# Altium project IR2136_SMD.PrjPcb
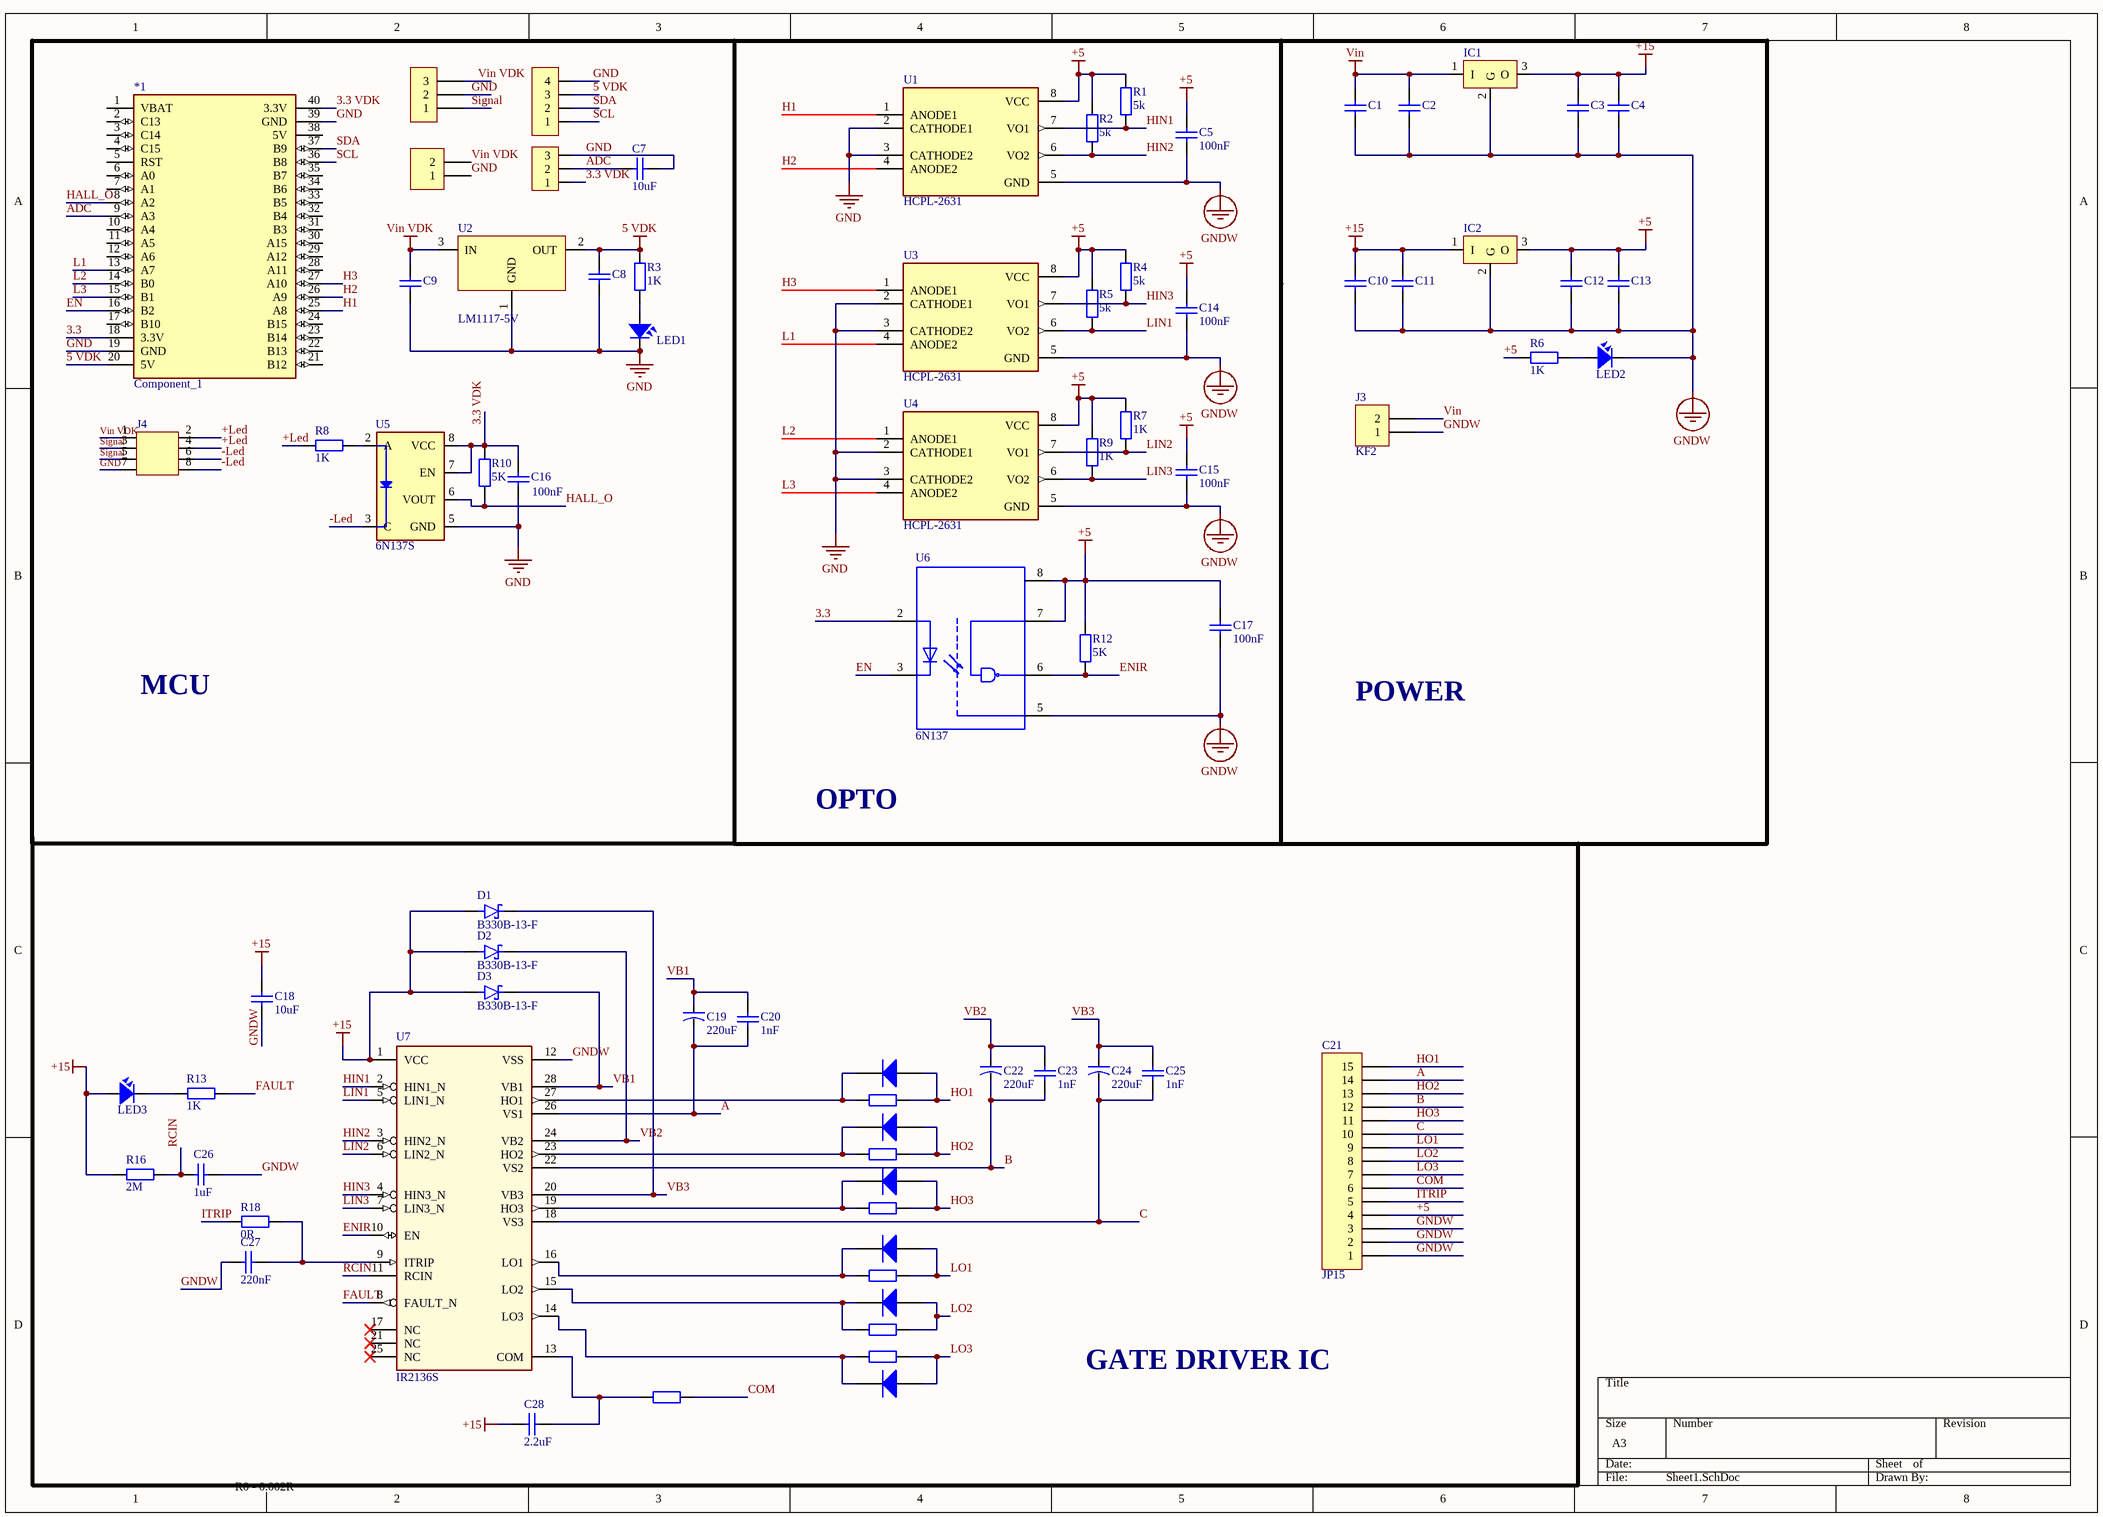
[diagram p0: Sheet1.SchDoc]
1 sheet, 76 parts. Net scope: global (net labels, ports and power ports of the same name join across sheets).
Board file: IR2136_SMD.PcbDoc

## Sheet Sheet1.SchDoc
size A3; SheetNumber: 1; SheetTotal: 1

### Parts
*1  Component_1  [PCBComponent_1]
C1  106  [tu 1206]  (value not drawn)
C2  106  [tu 1206]  (value not drawn)
C3  106  [tu 1206]  (value not drawn)
C4  106  [tu 1206]  (value not drawn)
C5  100nF  [tu 1206]
C6  Header3  [Header3]  (value not drawn)
C7  10uF  [tu 1206]
C8  106  [tu 1206]  (value not drawn)
C9  106  [tu 1206]  (value not drawn)
C10  106  [tu 1206]  (value not drawn)
C11  106  [tu 1206]  (value not drawn)
C12  106  [tu 1206]  (value not drawn)
C13  106  [tu 1206]  (value not drawn)
C14  100nF  [tu 1206]
C15  100nF  [tu 1206]
C16  100nF  [tu 1206]
C17  100nF  [tu 1206]
C18  10uF  [tu 1206]
C19  220uF  [CA-ALU-8]
C20  1nF  [tu 0805]
C21  JP15  [JP15-D1T]
C22  220uF  [CA-ALU-8]
C23  1nF  [tu 0805]
C24  220uF  [CA-ALU-8]
C25  1nF  [tu 0805]
C26  1uF  [tu 1206]
C27  220nF  [tu 1206]
C28  2.2uF  [tu 1206]
D1  B330B-13-F  [DIOM5336X240N]
D2  B330B-13-F  [DIOM5336X240N]
D3  B330B-13-F  [DIOM5336X240N]
D4  SS14  [DIODE SMA]  (value not drawn)
D5  SS14  [DIODE SMA]  (value not drawn)
D6  SS14  [DIODE SMA]  (value not drawn)
D7  SS14  [DIODE SMA]  (value not drawn)
D8  SS14  [DIODE SMA]  (value not drawn)
D9  SS14  [DIODE SMA]  (value not drawn)
IC1  LM78xx  [TO220-123]  (value not drawn)
IC2  LM78xx  [TO220-123]  (value not drawn)
J1  KF3  [KF3-5.08T]  (value not drawn)
J2  KF2  [KF2-5.08T]  (value not drawn)
J3  KF2  [KF2-5.08T]
J4  SAMTEC-TSM-102-01-X-DV  [SAMTEC-TSM-102-01-X-DV]  (value not drawn)
JP1  JP 1x4 2.54  [JP 1x4 DC]  (value not drawn)
LED1  LED  [LED-1206-Blue]  (value not drawn)
LED2  LED  [LED-1206-Blue]  (value not drawn)
LED3  LED  [LED-1206-Blue]  (value not drawn)
R1  5k  [tro smd 1206]
R2  5k  [tro smd 1206]
R3  1K  [tro smd 1206]
R4  5k  [tro smd 1206]
R5  5k  [tro smd 1206]
R6  1K  [tro smd 1206]
R7  1K  [tro smd 1206]
R8  1K  [tro smd 1206]
R9  1K  [tro smd 1206]
R10  5K  [tro smd 1206]
R12  5K  [tro smd 1206]
R13  1K  [tro smd 1206]
R14  680R  [tro smd 1206]  (value not drawn)
R15  680R  [tro smd 1206]  (value not drawn)
R16  2M  [tro smd 1206]
R17  680R  [tro smd 1206]  (value not drawn)
R18  0R  [tro smd 1206]
R19  680R  [tro smd 1206]  (value not drawn)
R20  680R  [tro smd 1206]  (value not drawn)
R21  680R  [tro smd 1206]  (value not drawn)
R22  1R  [tro smd 1206]  (value not drawn)
U1  HCPL-2631  [DIP762W65P254L965H470Q8]
U2  LM1117-5V  [SOT223]
U3  HCPL-2631  [DIP762W65P254L965H470Q8]
U4  HCPL-2631  [DIP762W65P254L965H470Q8]
U5  6N137S  [8-SMD]
U6  6N137  [DIP762W50P254L977H451Q8]
U7  IR2136S  [SOIC127P1032X265-28N]

### Blocks framed on the sheet
MCU: *1 C6-C9 C16 J1 J2 J4 JP1 LED1 R3 R8 R10 U2 U5

### Nets
5 VDK: *1.20(5V) C8.1 JP1.3 R3.1 U2.2(OUT)
+5: C5.2 C12.1 C13.1 C14.2 C15.2 C17.2 C21.4 IC2.3(O) R1.2 R2.2 R4.2 R5.2 R6.1 R7.2 R9.2 R12.2 U1.8(VCC) U3.8(VCC) U4.8(VCC) U6.7(VE) U6.8(VCC)
+15: C3.1 C4.1 C10.1 C11.1 C18.2 C28.2 D1.A D2.A D3.A IC1.3(O) IC2.1(I) LED3.1 R16.2 U7.1(VCC)
GND: *1.19(GND) *1.39(GND) C6.3 C7.1 C8.2 C9.2 C16.1 J1.2 J2.1 J4.7 JP1.4 LED1.2 U1.2(CATHODE1) U1.3(CATHODE2) U2.1(GND) U3.2(CATHODE1) U3.3(CATHODE2) U4.2(CATHODE1) U4.3(CATHODE2) U5.5(GND)
GNDW: C1.2 C2.2 C3.2 C4.2 C5.1 C10.2 C11.2 C12.2 C13.2 C14.1 C15.1 C17.1 C18.1 C21.1 C21.2 C21.3 C26.2 C27.2 IC1.2(G) IC2.2(G) J3.1 LED2.2 U1.5(GND) U3.5(GND) U4.5(GND) U6.5(GND) U7.12(VSS)
Vin: C1.1 C2.1 IC1.1(I) J3.2
Vin VDK: C9.1 J1.3 J2.2 J4.1 U2.3(IN)
3.3: *1.18(3.3V) U6.2(A)
3.3 VDK: *1.40(3.3V) C6.1 C16.2 R10.2 U5.7(EN) U5.8(VCC)
+Led: J4.2 J4.4 R8.2
-Led: J4.6 J4.8 U5.3(C)
A: C19.2 C20.2 C21.14 U7.26(VS1)
ADC: *1.9(A3) C6.2 C7.2
B: C21.12 C22.2 C23.2 U7.22(VS2)
C: C21.10 C24.2 C25.2 U7.18(VS3)
COM: C21.6 R22.1
EN: *1.16(B2) U6.3(C)
ENIR: R12.1 U6.6(VO) U7.10(EN)
FAULT: R13.2 U7.8(FAULT_N)
H1: *1.25(A8) U1.1(ANODE1)
H2: *1.26(A9) U1.4(ANODE2)
H3: *1.27(A10) U3.1(ANODE1)
HALL_O: *1.8(A2) R10.1 U5.6(VOUT)
HIN1: R1.1 U1.7(VO1) U7.2(HIN1_N)
HIN2: R2.1 U1.6(VO2) U7.3(HIN2_N)
HIN3: R4.1 U3.7(VO1) U7.4(HIN3_N)
HO1: C21.15 D4.1(A) R14.1
HO2: C21.13 D5.1(A) R15.1
HO3: C21.11 D6.1(A) R17.1
ITRIP: C21.5 R18.1
L1: *1.13(A7) U3.4(ANODE2)
L2: *1.14(B0) U4.1(ANODE1)
L3: *1.15(B1) U4.4(ANODE2)
LIN1: R5.1 U3.6(VO2) U7.5(LIN1_N)
LIN2: R7.1 U4.7(VO1) U7.6(LIN2_N)
LIN3: R9.1 U4.6(VO2) U7.7(LIN3_N)
LO1: C21.9 D7.1(A) R19.1
LO2: C21.8 D8.1(A) R20.1
LO3: C21.7 D9.1(A) R21.1
RCIN: C26.1 R16.1 U7.11(RCIN)
SCL: *1.36(B8) JP1.1
SDA: *1.37(B9) JP1.2
Signal: J1.1 J4.3 J4.5
VB1: C19.1 C20.1 D3.C(K) U7.28(VB1)
VB2: C22.1 C23.1 D2.C(K) U7.24(VB2)
VB3: C24.1 C25.1 D1.C(K) U7.20(VB3)
NetC27_1: C27.1 R18.2 U7.9(ITRIP)
NetC28_1: C28.1 R22.2 U7.13(COM)
NetD4_2: D4.2(K) R14.2 U7.27(HO1)
NetD5_2: D5.2(K) R15.2 U7.23(HO2)
NetD6_2: D6.2(K) R17.2 U7.19(HO3)
NetD7_2: D7.2(K) R19.2 U7.16(LO1)
NetD8_2: D8.2(K) R20.2 U7.15(LO2)
NetD9_2: D9.2(K) R21.2 U7.14(LO3)
NetLED1_1: LED1.1 R3.2
NetLED2_1: LED2.1 R6.2
NetLED3_2: LED3.2 R13.1
NetR8_1: R8.1 U5.2(A)

Not connected (* = marked no-connect by the designer): *1 1(VBAT) 2(C13) 3(C14) 4(C15) 5(RST) 6(A0) 7(A1) 10(A4) 11(A5) 12(A6) 17(B10) 21(B12) 22(B13) 23(B14) 24(B15) 28(A11) 29(A12) 30(A15) 31(B3) 32(B4) 33(B5) 34(B6) 35(B7) 38(5V); U7 17(NC)* 21(NC)* 25(NC)*

### Notes on the sheet
- POWER
- OPTO
- GATE DRIVER IC
- R0 - 0.002R

### Library data of the parts
C1-C4 C8-C13 = Tu 1206 106 16V 20%: Dán; Don_Vi: Con; So_Chan: 2; Ten_Linh_Kien: Tụ 1206 106-10uF 20% 16V; Ma_Hang: MH004541; Chung_Loai: Dán; Kieu_Chan: *
C5 C7 C14-C18 C26-C28 = Tu 1206 470pF 50V 10%: Dán; Don_Vi: Con; So_Chan: 2; Ten_Linh_Kien: Tụ 1206 470P 10% 50V; Ma_Hang: MH004548; Chung_Loai: Dán; Kieu_Chan: *
C6 = Header3: Header IDC, 3 x 1 Pin Vertical 2.54mm Pitch (Non-Boxed, Male); Manufacturer: W¨¹rth Elektronik eiSos GmbH; partNo: 613002143121; ComponentLink1 Description: Manufacturer; ComponentLink2 Description: Datasheet; NoPins: 02; Created Date: 29 March 2013; ComponentLink1URL: http://www.we-online.com; ComponentLink2URL: http://katalog.we-online.de/em/datasheet/6130xx143121.pdf; Created by: Karrer Zheng
C19 C22 C24 = CN-ALU-DIP: Capacitor (Semiconductor SIM Model); Value: 104; LatestRevisionDate: 17-Jul-2002; LatestRevisionNote: Re-released for DXP Platform.; PackageReference: C1206; Publisher: Altium Limited
C20 C23 C25 = Tu 0805 20pF 50V 10%: Dán; Don_Vi: Con; Ten_Linh_Kien: Tụ 0805 20P 10% 50V; So_Chan: 2; Ma_Hang: MH004558; Chung_Loai: Dán; Kieu_Chan: *
C21 = JP15: WR-PHD 2.54 mm Angled Socket Header; Manufacturer: W¨¹rth Elektronik eiSos GmbH; partNo: 613015143121; ComponentLink1 Description: Manufacturer; ComponentLink2 Description: Datasheet; NoPins: 15; Created Date: 29 March 2013; ComponentLink1URL: http://www.we-online.com; ComponentLink2URL: http://katalog.we-online.de/em/datasheet/6130xx143121.pdf; Created by: Karrer Zheng
D1-D3 = B330B-13-F: Diode Schottky 30 V 3A Surface Mount SMB; MF: Diodes Inc.; Value: *; Check_prices: https://www.snapeda.com/parts/B330B-13-F/Diodes+Inc./view-part/?ref=eda; Availability: In Stock; Package: DO-214 Diodes Inc.; SnapEDA_Link: https://www.snapeda.com/parts/B330B-13-F/Diodes+Inc./view-part/?ref=snap; Price: None; Purchase-URL: https://pricing.snapeda.com/search/part/B330B-13-F/?ref=eda; MP: B330B-13-F
D4-D9 = Diode SS14 ( 1N5819): Dán; Ma_Hang: MH002211; Don_Vi: Con; Ten_Linh_Kien: Diode SS14 DO214 Schottky 1A 40V ( 1N5819 DO214); Chung_Loai: Dán; Ghi_Chu: *; Kieu_Chan: *
IC1 IC2 = LM78xx: Positive Voltage Regulator; Note: Tab is connected to pin 3 (GND).; Published: 24-Aug-2001; LatestRevisionDate: 17-Jul-2002; LatestRevisionNote: Re-released for DXP Platform.; DatasheetVersion: Apr-1994; PackageVersion: Jul-1998; PackageReference: ISOWATT220AB; Publisher: Altium Limited; PackageDescription: TO, Thru-Hole, Vertical, Heatsink Mounted; 3 In-Line Leads; Pitch 2.54 mm; Pin sequence 1, 3, 2; ComponentLink1Description: Manufacturer Link; ComponentLink1URL: http://www.st.com/; ComponentLink2Description: Datasheet; ComponentLink2URL: http://www.st.com/stonline/products/literature/ds/2146/l78m05c.pdf
J1 = KF3: Manufacturer: Würth Elektronik eiSos GmbH; partNo: 691103110003; ComponentLink1 Description: Manufacturer; ComponentLink2 Description: Datasheet; NoPins: 3; Created Date: 29 October 2013; ComponentLink1URL: http://www.we-online.com; ComponentLink2URL: http://katalog.we-online.de/em/datasheet/6911031100xx.pdf; Created by: Karrer Zheng
J2 J3 = KF2: Manufacturer: Würth Elektronik eiSos GmbH; partNo: 691103110002; ComponentLink1 Description: Manufacturer; ComponentLink2 Description: Datasheet; NoPins: 2; Created Date: 29 October 2013; ComponentLink1URL: http://www.we-online.com; ComponentLink2URL: http://katalog.we-online.de/em/datasheet/6911031100xx.pdf; Created by: Karrer Zheng
J4 = SAMTEC-TSM-102-01-X-DV: TSM Series .100 Surface Mount Terminal Strip; MF: Samtec; MP: TSM-102-01-F-DV; Value: *; SnapEDA_Link: https://www.snapeda.com/parts/TSM-102-01-F-DV/Samtec%20Inc./view-part/2805976/?ref=snap; Package: None; Digi-Key_Part_Number: TSM-102-01-F-DV-ND; Digi-Key_Purchase_URL: https://www.digikey.com/product-detail/en/samtec-inc/TSM-102-01-F-DV/TSM-102-01-F-DV-ND/7623428?utm_source=snapeda&utm_medium=aggregator&utm_campaign=symbol
JP1 = JP 1x4 2.54 Duc Cong: Cắm; Ten_Linh_Kien: Jump Đơn Đực 2.54MM 1x40P Cong Đứng; Don_Vi: Con; Ma_Hang: MH000904; Ghi_Chu: *; Kieu_Chan: *; Chung_Loai: Cắm
LED1-LED3 = LED SMD: Value: LED 3 - 5 ly 2 Colour
R1-R10 R12-R22 = Tro 1206 5% 680R: Dán; Don_Vi: Con; So_Chan: 2; Ten_Linh_Kien: Trở 1206 5% 680R; Ma_Hang: MH005928; Chung_Loai: Dán; Kieu_Chan: *
U1 U3 U4 = HCPL-2631: Logic Output Optoisolator 10MBd Open Collector, Schottky Clamped 3750Vrms 2 Channel 10kV/Âµs CMTI 8-DIP Gull Wing; MF: Broadcom Limited; Price: None; Value: *; Package: DIP-8 Broadcom; SnapEDA_Link: https://www.snapeda.com/parts/HCPL-2631/Broadcom%20Limited/view-part/1749269/?ref=snap; Availability: Unavailable; MP: HCPL-2631
U2 = LM1117: 800mA Low-Dropout Linear Regulator; Creator: Nguyen Ba Bien; Website: http://group3i.net
U5 = 6N137S: Logic Output Optoisolator 15MBd Open Collector 5000Vrms 1 Channel 10kV/Âµs CMTI 8-SMD; MF: Lite-On Inc.; SnapEDA_Link: https://www.snapeda.com/parts/6N137S/Lite-On+Inc./view-part/?ref=snap; Package: SMD-8 Lite-On Inc.; Purchase-URL: https://pricing.snapeda.com/search/part/6N137S/?ref=eda; Price: None; Value: *; MP: 6N137S; Availability: In Stock; Check_prices: https://www.snapeda.com/parts/6N137S/Lite-On+Inc./view-part/?ref=eda
U6 = 6N137: Optoaislador de salida lÃ³gica 10Mbps Open Collector 5000Vrms 1 Channel 5kV / Âµs CMTI 8-DIP; MF: Everlight Electronics; MP: 6N137; Availability: Unavailable; Package: DIP-8 Broadcom; Value: *; Price: None; SnapEDA_Link: https://www.snapeda.com/parts/6N137/Everlight%20Electronics%20Co%20Ltd/view-part/1771557/?ref=snap
U7 = IR2136S: High Voltage Gate Driver IC; Manufacturer: Infineon Technologies; Manufacturer Order Number: IR2136S; PackageReference: PG-DSO-28-901